# EAGLE design BSK5 (EAGLE 9.4.2)
ESKD_DESCRIPTION1: 207|235|224|242|224|32|193|209|202|53; ESKD_DESCRIPTION2: 241|245|229|236|224|32|253|235|229|234|242|240|232|247|229|241|234|224|255; ESKD_DESCRIPTION3: 239|240|232|237|246|232|239|232|224|235|252|237|224|255; ESKD_NUMBER: 67|67|83|49|46|50|54|48|48|45|48|221|51; ESKD_NUMBER_SHEET: 49; ESKD_SHEETS: 49
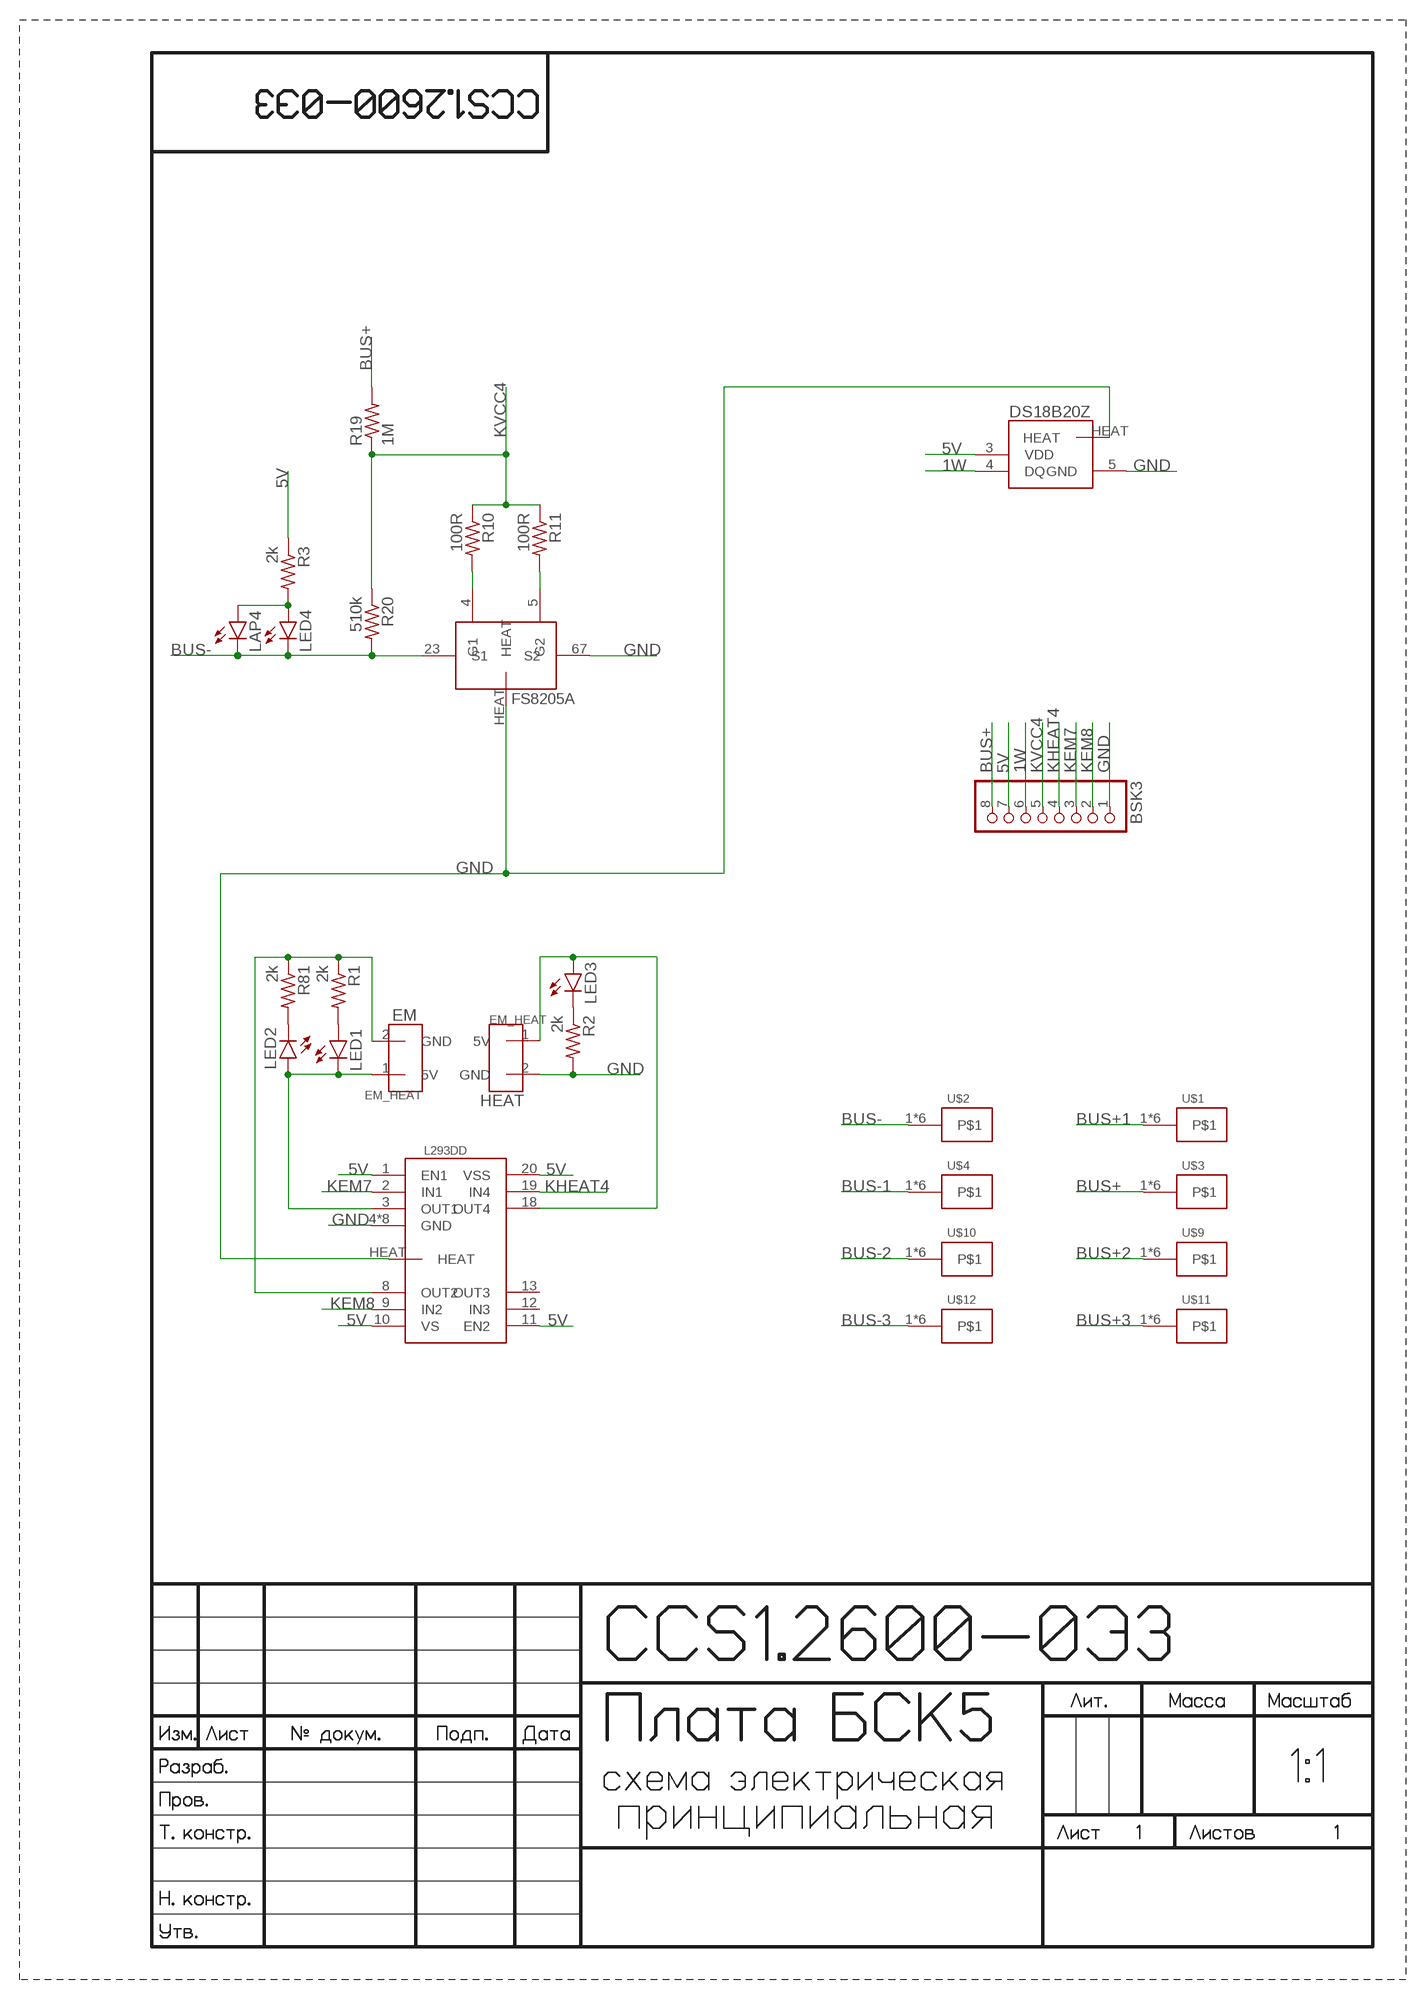
[diagram p0: schematic, sheet 1]

## Parts
BSK3  PINHD-1X8  [1X08]
DS18B20  DS18B20Z  [DS18B20Z]
FS8205A  FS8205A+  [FS8205A+]
L293DD  L293DD  [L293DD]
LAP4  LAP4-BOTTOM  [P47F-BOTTOM]
LED1  LEDCHIPLED_0603  [CHIPLED_0603]
LED2  LEDCHIPLED_0603  [CHIPLED_0603]
LED3  LEDCHIPLED_0603  [CHIPLED_0603]
LED4  LEDCHIPLED_0603  [CHIPLED_0603]
R1  2k  R-US_R0603  [R0603]
R2  2k  R-US_R0603  [R0603]
R3  2k  R-US_R0603  [R0603]
R10  100R  R-US_R0603  [R0603]
R11  100R  R-US_R0603  [R0603]
R19  1M  R-US_R0603  [R0603]
R20  510k  R-US_R0603  [R0603]
R81  2k  R-US_R0603  [R0603]
U$1  KCONNECT  [KCONNECT]
U$2  KCONNECT  [KCONNECT]
U$3  KCONNECT  [KCONNECT]
U$4  KCONNECT  [KCONNECT]
U$6  EM_HEAT  [EM_HEAT]
U$7  EM_HEAT  [EM_HEAT]
U$9  KCONNECT  [KCONNECT]
U$10  KCONNECT  [KCONNECT]
U$11  KCONNECT  [KCONNECT]
U$12  KCONNECT  [KCONNECT]

## Nets
1W: BSK3.6 DS18B20.4(DQ)
5V: BSK3.7 DS18B20.3(VDD) L293DD.1(EN1) L293DD.10(VS) L293DD.11(EN2) L293DD.20(VSS) R3.1
BUS+: BSK3.8 R19.2 U$3.1 U$3.2 U$3.3 U$3.4 U$3.P$1 U$3.P$2
BUS+1: U$1.1 U$1.2 U$1.3 U$1.4 U$1.P$1 U$1.P$2
BUS+2: U$9.1 U$9.2 U$9.3 U$9.4 U$9.P$1 U$9.P$2
BUS+3: U$11.1 U$11.2 U$11.3 U$11.4 U$11.P$1 U$11.P$2
BUS-: FS8205A.23(S1) LAP4.C LED4.C R20.2 U$2.1 U$2.2 U$2.3 U$2.4 U$2.P$1 U$2.P$2
BUS-1: U$4.1 U$4.2 U$4.3 U$4.4 U$4.P$1 U$4.P$2
BUS-2: U$10.1 U$10.2 U$10.3 U$10.4 U$10.P$1 U$10.P$2
BUS-3: U$12.1 U$12.2 U$12.3 U$12.4 U$12.P$1 U$12.P$2
GND: BSK3.1 DS18B20.5(GND) DS18B20.HEAT FS8205A.67(S2) FS8205A.HEAT L293DD.4(GND) L293DD.5(GND) L293DD.6(GND) L293DD.7(GND) L293DD.14(GND) L293DD.15(GND) L293DD.16(GND) L293DD.17(GND) L293DD.HEAT R2.2 U$7.2(GND)
KEM7: BSK3.3 L293DD.2(IN1)
KEM8: BSK3.2 L293DD.9(IN2)
KHEAT4: BSK3.4 L293DD.19(IN4)
KVCC4: BSK3.5 R10.1 R11.1 R19.1 R20.1
N$1: L293DD.3(OUT1) LED1.C LED2.A U$6.1(5V)
N$2: L293DD.8(OUT2) R1.1 R81.1 U$6.2(GND)
N$3: L293DD.18(OUT4) LED3.A U$7.1(5V)
N$8: FS8205A.4(G1) R10.2
N$9: FS8205A.5(G2) R11.2
N$26: LED2.C R81.2
N$27: LED1.A R1.2
N$28: LED3.C R2.1
N$29: LAP4.A LED4.A R3.2
Unconnected: L293DD.12(IN3) L293DD.13(OUT3)

## Notes on the sheet
- EM
- HEAT

## Library data of the parts
BSK3 = pinheadCS:PINHD-1X8: PIN HEADER
DS18B20 = CanCubeSat:DS18B20Z
FS8205A = CanCubeSat:FS8205A+
L293DD = CanCubeSat:L293DD
LAP4 = led:*P4: PointLED® Enhanced Thinfilm LED TOP & BOTTOM mount LS P47F, LR P47F, LA P47F, LY P47F, LT P4SG, LB P4SG, LW P4SG Source: http://catalog.osram-os.com .. LA_LR_LS_LY_P47F_Pb_free.pdf
LED1-LED4 = led:LED: LED OSRAM: - CHIPLED LG R971, LG N971, LY N971, LG Q971, LY Q971, LO R971, LY R971 LH N974, LH R974 LS Q976, LO Q976, LY Q976 LO Q996 - Hyper CHIPLED LW Q18S LB Q993, LB Q99A, LB R99A - SideLED LS A670, LO A670, LY A670, LG A670, LP A670 LB A673, LV A673, LT A673, LW A673 LH A674 LY A675 LS A676, LA A676, LO A676, LY A676, LW A676 LS A679, LY A679, LG A679 - Hyper Micro SIDELED® LS Y876, LA Y876, LO Y876, LY Y876 LT Y87S - SmartLED LW L88C, LW L88S LB L89C, LB L89S, LG L890 LS L89K, LO L89K, LY L89K LS L896, LA L896, LO L896, LY L896 - TOPLED LS T670, LO T670, LY T670, LG T670, LP T670 LSG T670, LSP T670, LSY T670, LOP T670, LYG T670 LG T671, LOG T671, LSG T671 LB T673, LV T673, LT T673, LW T673 LH T674 LS T676, LA T676, LO T676, LY T676, LB T676, LH T676, LSB T676, LW T676 LB T67C, LV T67C, LT T67C, LS T67K, LO T67K, LY T67K, LW E67C LS E67B, LA E67B, LO E67B, LY E67B, LB E67C, LV E67C, LT E67C LW T67C LS T679, LY T679, LG T679 LS T770, LO T770, LY T770, LG T770, LP T770 LB T773, LV T773, LT T773, LW T773 LH T774 LS E675, LA E675, LY E675, LS T675 LS T776, LA T776, LO T776, LY T776, LB T776 LHGB T686 LT T68C, LB T68C - Hyper Mini TOPLED® LB M676 - Mini TOPLED Santana® LG M470 LS M47K, LO M47K, LY M47K Source: http://www.osram.convergy.de LUXEON: - LUMILED® LXK2-PW12-R00, LXK2-PW12-S00, LXK2-PW14-U00, LXK2-PW14-V00 LXK2-PM12-R00, LXK2-PM12-S00, LXK2-PM14-U00 LXK2-PE12-Q00, LXK2-PE12-R00, LXK2-PE12-S00, LXK2-PE14-T00, LXK2-PE14-U00 LXK2-PB12-K00, LXK2-PB12-L00, LXK2-PB12-M00, LXK2-PB14-N00, LXK2-PB14-P00, LXK2-PB14-Q00 LXK2-PR12-L00, LXK2-PR12-M00, LXK2-PR14-Q00, LXK2-PR14-R00 LXK2-PD12-Q00, LXK2-PD12-R00, LXK2-PD12-S00 LXK2-PH12-R00, LXK2-PH12-S00 LXK2-PL12-P00, LXK2-PL12-Q00, LXK2-PL12-R00 Source: www.luxeon.com KINGBRIGHT: KA-3528ASYC Source: www.kingbright.com
R1-R3 R10 R11 R19 R20 R81 = resistor:R-US_: RESISTOR, American symbol
U$1-U$4 U$9-U$12 = CanCubeSat:KCONNECT
U$6 U$7 = CanCubeSat:EM_HEAT

## Board
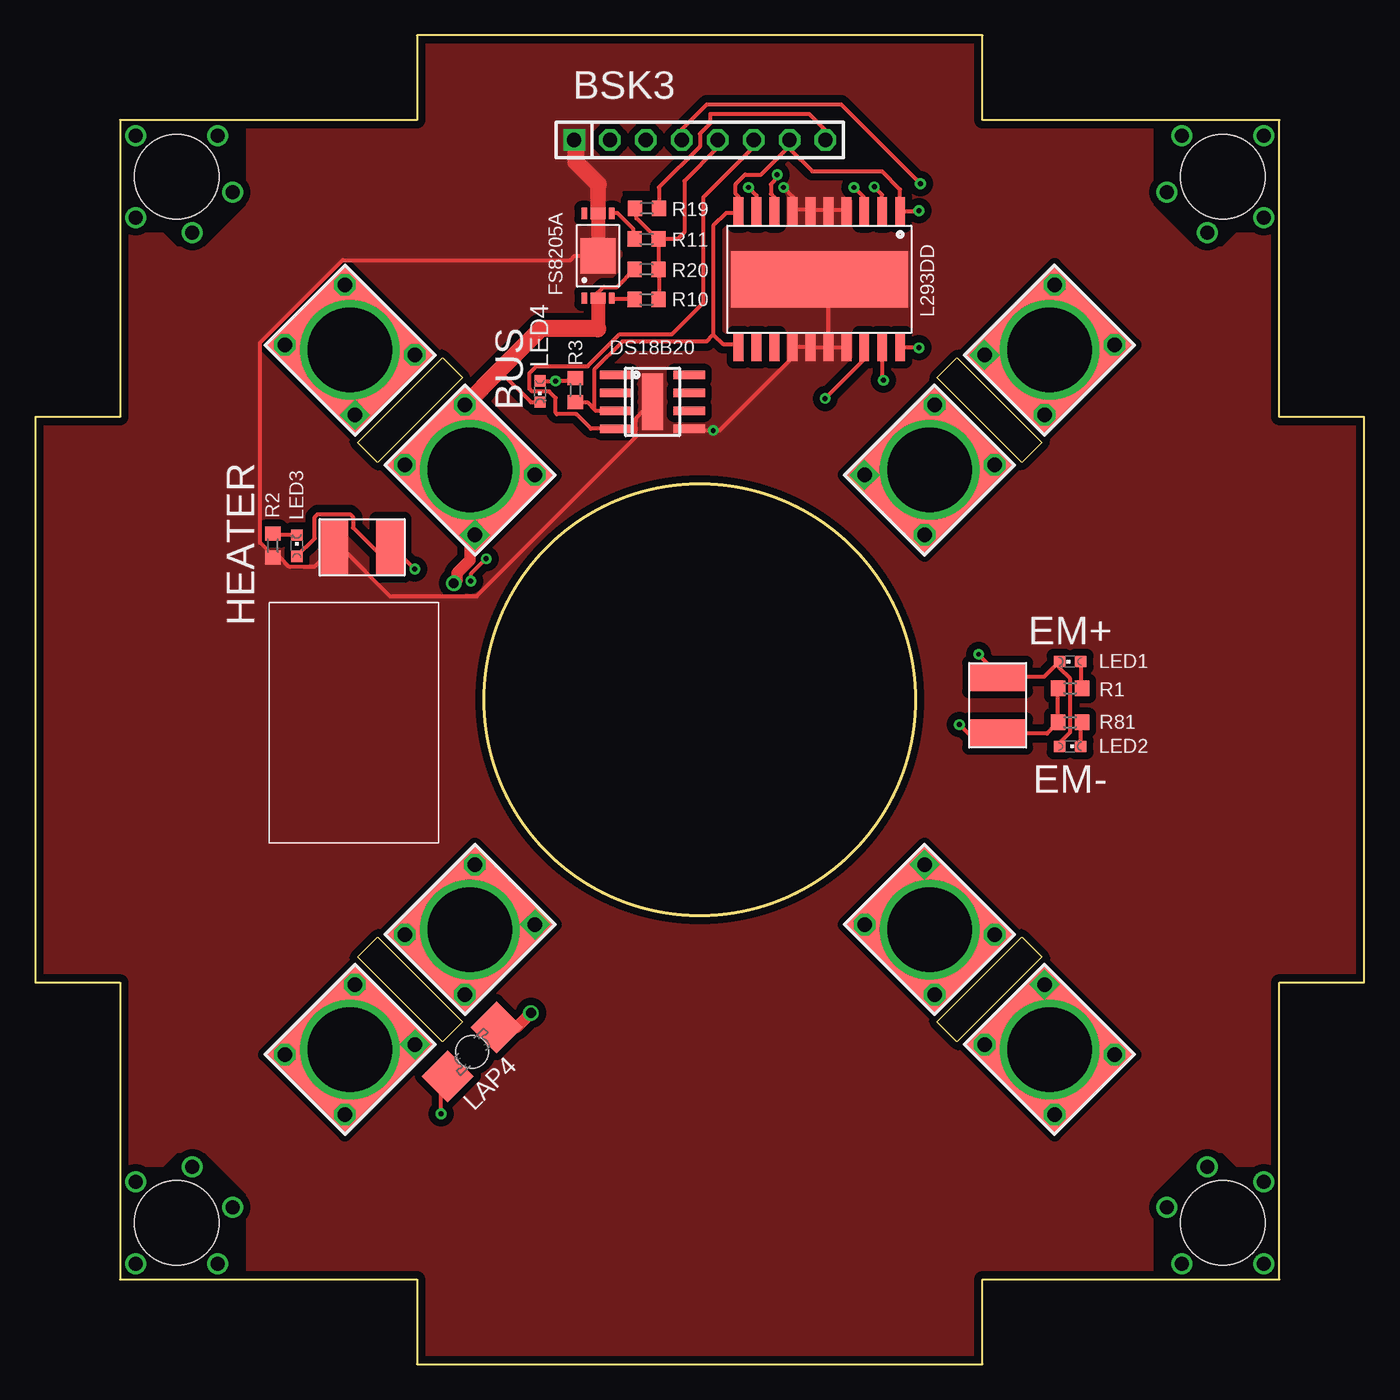
[diagram p1: board, top side]
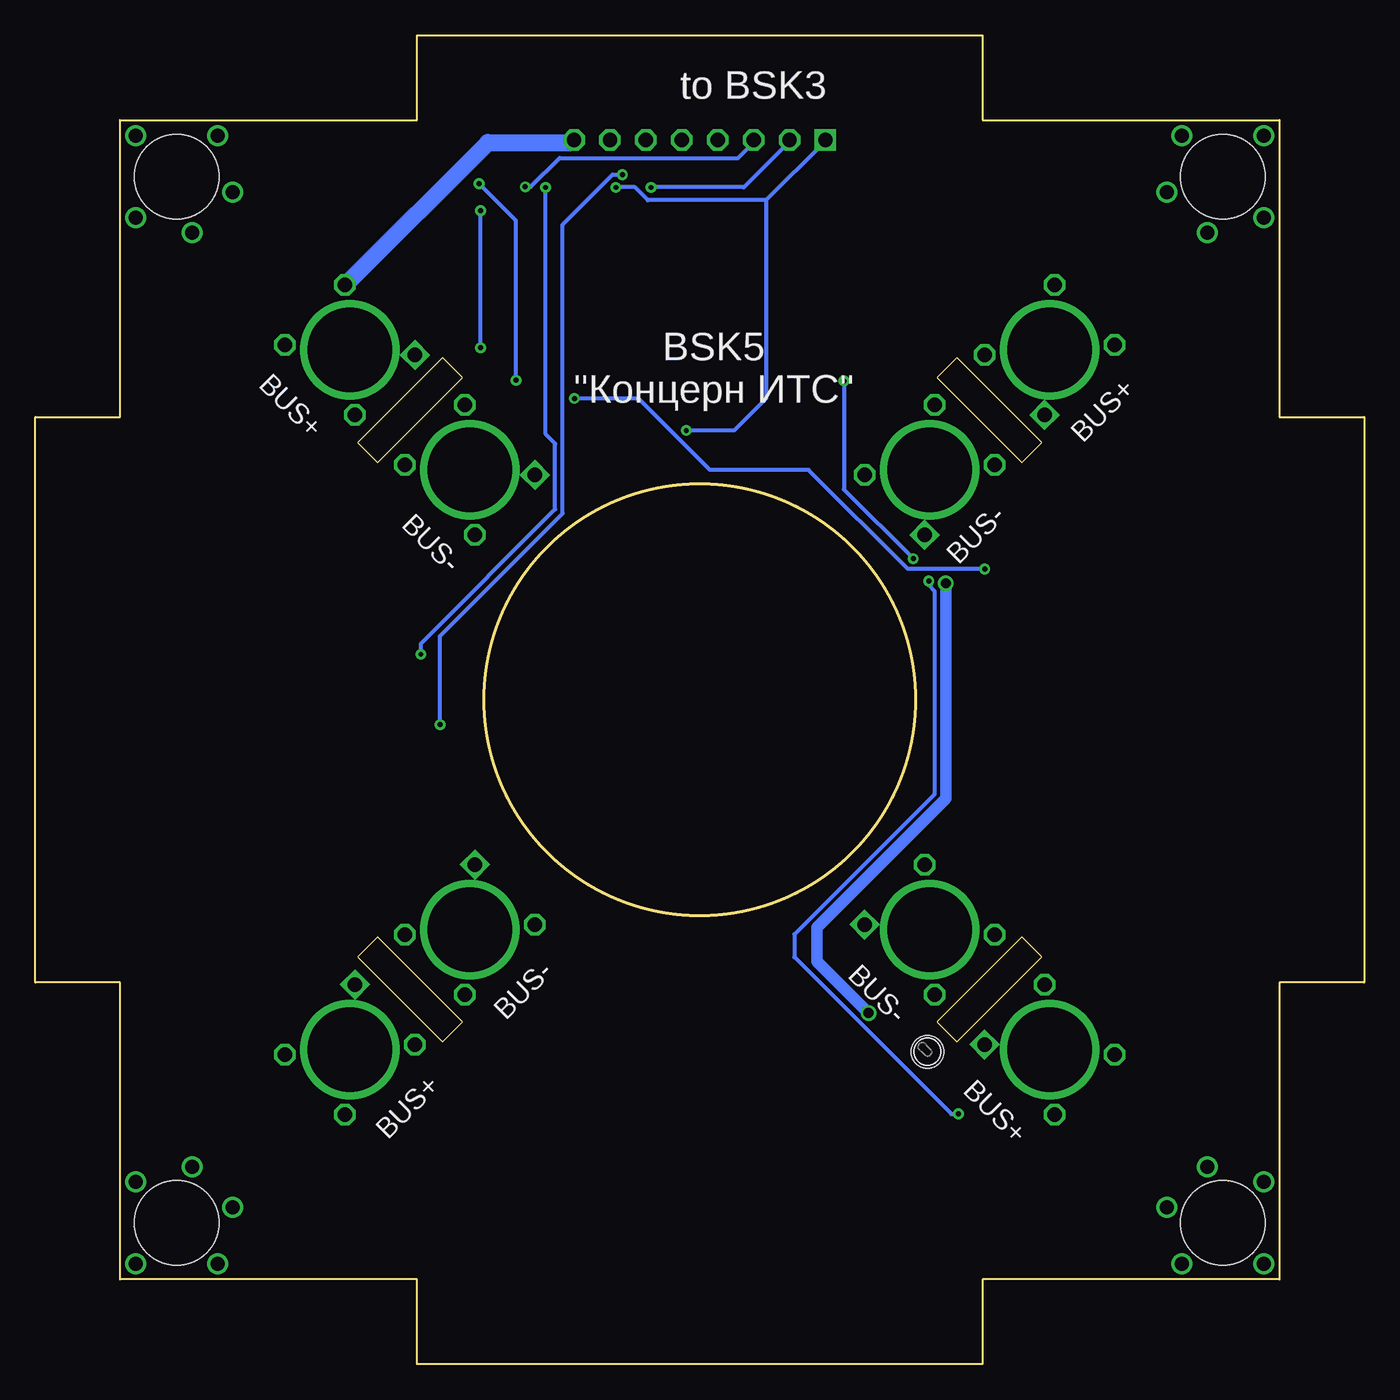
[diagram p2: board, bottom side, seen from below]

Size 94 x 94 mm. Coordinates in mm from the lower left corner, seen from the top.
Outline: 27,0 67,0 67,6 88,6 88,27 94,27 94,67 88,67 88,88 67,88 67,94 27,94 27,88 6,88 6,67 0,67 0,27 6,27 6,6 27,6 27,0
Outline: 63.79,24.2 69.8,30.21 71.22,28.79 65.21,22.78 63.79,24.2
Outline: 22.78,65.21 28.79,71.22 30.21,69.8 24.2,63.79 22.78,65.21
Outline: 69.8,63.79 63.79,69.8 65.21,71.22 71.22,65.21 69.8,63.79
Outline: 28.79,22.78 22.78,28.79 24.2,30.21 30.21,24.2 28.79,22.78
Outline: circle at 47,47 radius 15.25
Copper layers (1*16): Top 0.035mm / dielectric 1.5mm / Bottom 0.035mm
Design rules "default *": minimum track width 0.3mm, minimum drill 0.35mm, track to track 0.2mm, track to pad 0.2mm, pad to pad 0.2mm, via to via 0.2mm, smd to smd 0.2mm, copper to edge 0.25mm, drill to drill 6mil, minimum pad ring 10mil, minimum via ring 8mil, stop-mask expansion 2mil, vias tented up to drill 0mil, thermal gap 10mil
Holes 6 mm at 10,10 84,84 10,84 84,10

### Footprints (pad centres in the part's own frame; a part is rotated, then mirrored left to right if it is on the bottom)
1X08 = drill 1.016 square: 1 -8.89,0 | drill 1.016 octagon: 2 -6.35,0; 3 -3.81,0; 4 -1.27,0; 5 1.27,0; 6 3.81,0; 7 6.35,0; 8 8.89,0
DS18B20Z = smd 0.6 x 2.2: 1 -1.905,-2.6; 2 -0.635,-2.6; 3 0.635,-2.6; 4 1.905,-2.6; 5 1.905,2.6; 6 0.635,2.6; 7 -0.635,2.6; 8 -1.905,2.6 | smd 4 x 1.5: HEAT 0,0
FS8205A+ = smd 0.4 x 0.8: 1 -0.975,-3; 4 0.975,-3; 5 0.975,3; 8 -0.975,3 | smd 1.05 x 0.8: 23 0,-3; 67 0,3 | smd 2.5 x 2.5: HEAT 0,0
L293DD = smd 0.7 x 2: 1 -5.715,-4.8; 2 -4.445,-4.8; 3 -3.175,-4.8; 4 -1.905,-4.8; 5 -0.635,-4.8; 6 0.635,-4.8; 7 1.905,-4.8; 8 3.175,-4.8; 9 4.445,-4.8; 10 5.715,-4.8; 11 5.715,4.8; 12 4.445,4.8; 13 3.175,4.8; 14 1.905,4.8; 15 0.635,4.8; 16 -0.635,4.8; 17 -1.905,4.8; 18 -3.175,4.8; 19 -4.445,4.8; 20 -5.715,4.8 | smd 12.5 x 4: HEAT 0,0
P47F-BOTTOM = smd 2.6 x 2.6: A -2.45,0; C 2.45,0 | hole 2.3: 0,0
CHIPLED_0603 = smd 0.8 x 0.8: A 0,-0.75; C 0,0.75
R0603 = smd 1 x 1.1: 1 -0.85,0; 2 0.85,0
KCONNECT = drill 1.016 square: 1 -3,-3.5 | drill 1.016 octagon: 2 -3,3.5; 3 3,-3.5; 4 3,3.5 | drill 6: P$1 0,0 | smd 8 x 9: P$2 0,0
EM_HEAT = smd 2 x 4: 1 -2,0; 2 2,0

### Placement (x,y rotation side)
BSK3  47,86.6 0 top
DS18B20  43.66,68.07 270 top
FS8205A  39.8,78.41 0 top
L293DD  55.46,76.74 180 top
LAP4  30.9,22.1 45 top
LED1  73.2,49.7 90 top
LED2  73.2,43.7 270 top
LED3  18.5,57.9 0 top
LED4  35.7,68.8 180 top
R1  73.2,47.8 0 top
R2  16.8,57.9 270 top
R3  38.2,68.9 90 top
R10  43.24,75.31 180 top
R11  43.24,79.59 180 top
R19  43.26,81.77 0 top
R20  43.24,77.45 180 top
R81  73.2,45.4 0 top
U$1  22.25,71.75 45 top
U$2  30.74,63.26 45 top
U$3  71.75,71.75 315 top
U$4  63.26,63.26 315 top
U$6  68.07,46.61 270 top
U$7  23.11,57.78 180 top
U$9  22.25,22.25 135 top
U$10  30.74,30.74 135 top
U$11  71.75,22.25 225 top
U$12  63.26,30.74 225 top

### Tracks (layer width: path | path; a pad name or v marks a point on that pad's centre or on a via)
1W
  Top 0.3: DS18B20.4 39.3,66.17 38.27,67.2 36.91,67.2 36.8,67.31 36.8,68.34 36.34,68.8 35.16,68.8 34.95,69 34.95,70.09 35.45,70.6 39.08,70.6 41.33,72.85 45.03,72.85 47.26,75.08 47.26,82.55 50.81,86.1 BSK3.6
5V  (via drill 0.35)
  Top 0.3: 47.95,72.84 48.63,72.16 49.54,72.16 L293DD.11 | 47.95,72.84 47.95,80.53 48.86,81.43 49.54,81.43 L293DD.10 49.76,81.66 49.76,82.56 49.54,82.79 49.54,83.47 50.22,84.15 51.35,84.15 53.35,86.15 BSK3.7 53.35,85.99 54.97,84.37 59.9,84.37 61.17,83.1 L293DD.1 62.44,81.54 v62.5,81.6 | 47.95,72.84 47.47,72.35 41.53,72.35 39.53,70.35 39.53,67.56 | L293DD.20 62.26,71.94 62.3,71.9 v62.5,71.9 | DS18B20.3 39.66,67.44 39.53,67.56 | R3.1 39.05,68.05 39.53,67.56
  Bottom 0.3: v62.5,71.9 v62.5,81.6
BUS+
  Top 0.3: R19.2 44.11,81.88 44.11,83.24 47,86.14 47,87.04 47.73,87.77 47.73,88.43 54.75,88.43 55.89,87.3 BSK3.8 | 71.48,71.48 71.48,67.18 U$3.3 | U$3.P$2 71.48,71.48 | 71.48,71.48 67.18,71.48 U$3.1 | 72.16,71.93 71.93,71.93 U$3.P$2 | 72.16,71.93 76.23,71.93 U$3.4 | 72.16,71.93 72.16,76.23 U$3.2 | 72.16,71.93 U$3.P$2
  Bottom 1.2: BSK3.8 56.1,86.41 61.98,86.41 71.93,76.46 U$3.2
BUS+1
  Top 0.3: 21.94,71.93 22.17,71.93 U$1.P$2 | 21.94,71.93 17.87,71.93 U$1.2 | 21.94,71.93 21.94,76.23 U$1.4 | 21.94,71.93 U$1.P$2 | 22.39,71.48 22.39,71.7 U$1.P$2 | 22.39,71.48 22.39,67.18 U$1.1 | 22.39,71.48 26.69,71.48 U$1.3 | 22.39,71.48 U$1.P$2
BUS+2
  Top 0.3: 21.94,21.94 21.94,17.87 U$9.2 | U$9.P$2 21.94,21.94 | 21.94,21.94 17.87,21.94 U$9.4 | 22.39,22.62 22.39,22.39 U$9.P$2 | 22.39,22.62 22.39,26.69 U$9.3 | 22.39,22.62 26.69,22.62 U$9.1 | 22.39,22.62 U$9.P$2
BUS+3
  Top 0.3: 71.93,21.94 71.93,22.17 U$11.P$2 | 71.93,21.94 71.93,17.87 U$11.4 | 71.93,21.94 76.23,21.94 U$11.2 | 71.93,21.94 U$11.P$2 | 71.48,22.39 71.7,22.39 U$11.P$2 | 71.48,22.39 67.18,22.39 U$11.3 | 71.48,22.39 71.48,26.69 U$11.1 | 71.48,22.39 U$11.P$2
BUS-  (via drill 0.7)
  Top 0.3: 30.99,62.88 30.99,58.81 U$2.1 | 30.99,62.88 30.76,63.11 U$2.P$2 | 30.99,62.88 35.29,62.88 U$2.3 | 30.99,62.88 U$2.P$2 | 30.31,63.56 26.24,63.56 U$2.2 | 30.31,63.56 30.54,63.34 U$2.P$2 | 30.31,63.56 30.31,66.28 U$2.P$2 | 30.31,63.56 U$2.P$2 | FS8205A.23 39.8,75.8 40.2,76.2 41.14,76.2 R20.2 | 32.81,70.29 35.05,68.05 LED4.C
  Top 0.8: U$2.P$2 30.74,56.87 29.82,55.96 29.82,55.46 v29.6,55.24 | v35.06,24.84 34.05,23.83 LAP4.C
  Top 1: FS8205A.23 39.8,73.24
  Top 1.2: 30.31,66.28 30.31,67.63 U$2.4 32.81,70.29 35.76,73.24 39.8,73.24
  Bottom 0.8: v29.6,55.24 29.6,40 38.7,30.9 38.7,28.48 v35.06,24.84
BUS-1
  Top 0.3: 62.88,63.11 63.11,63.11 U$4.P$2 | 62.88,63.11 58.81,63.11 U$4.1 | 62.88,63.11 62.88,58.81 U$4.3 | 62.88,63.11 U$4.P$2 | 63.56,63.56 67.63,63.56 U$4.4 | 63.56,63.56 63.56,67.63 U$4.2 | 63.56,63.56 U$4.P$2
BUS-2
  Top 0.3: 30.54,30.54 30.54,26.24 U$10.2 | 30.54,30.54 26.24,30.54 U$10.4 | 30.54,30.54 U$10.P$2 | 30.99,31.22 30.99,30.99 U$10.P$2 | 30.99,31.22 30.99,35.29 U$10.3 | 30.99,31.22 35.29,31.22 U$10.1 | 30.99,31.22 U$10.P$2
BUS-3
  Top 0.3: 63.56,30.31 63.56,26.24 U$12.4 | 63.56,30.31 63.34,30.54 U$12.P$2 | 63.56,30.31 67.63,30.31 U$12.2 | 63.56,30.31 U$12.P$2 | 62.88,30.99 58.81,30.99 U$12.3 | 62.88,30.99 63.11,30.76 U$12.P$2 | 62.88,30.99 62.88,35.29 U$12.1 | 62.88,30.99 U$12.P$2
GND  (via drill 0.35)
  Top 0.3: L293DD.16 55.87,71.93 54.97,71.93 L293DD.15 54.74,71.93 53.61,71.93 L293DD.14 53.38,71.93 53.38,71.03 48.41,66.05 v47.95,66.05 46.37,66.05 DS18B20.5 | L293DD.17 57.23,71.93 L293DD.16 | 53.61,81.66 54.74,81.66 L293DD.6 54.97,81.66 55.87,81.66 L293DD.5 56.1,81.66 57.23,81.66 L293DD.4 | 53.61,81.66 53.61,82.56 v52.93,83.24 | 53.61,81.66 L293DD.7 | L293DD.16 56.09,76.11 L293DD.HEAT | FS8205A.HEAT 38.16,78.41 37.86,78.11 21.75,78.11 15.89,72.25 15.89,58.11 16.8,57.2 R2.2 17.3,57.05 17.95,56.4 19.73,56.4 U$7.2 21.62,57.78 25.07,54.34 31.22,54.34 42.51,65.62 42.51,66.92 DS18B20.HEAT
  Top 1: FS8205A.67 FS8205A.HEAT
  Top 1.1: 39.81,83.47 FS8205A.67
  Top 1.2: 39.81,83.47 38.23,85.05 38.23,86.41 BSK3.1
  Bottom 0.3: v52.93,83.24 51.57,83.24 50.67,82.34 42.3,82.34 | 42.3,82.34 38.23,86.41 BSK3.1 | 42.3,82.34 42.3,68.31 44.56,66.05 v47.95,66.05
  pour Top (isolate 0.5, no thermals): 6,80 9,80 10,79 12,79 15,82 15,88 27,88 27,94 67,94 67,88 78,88 79,88 79,82 82,79 84,79 85,80 88,80 88,67 94,67 94,27 88,27 88,15 88,14 85,14 84,15 82,15 79,12 79,6 67,6 67,0 27,0 27,6 15,6 15,12 12,15 10,15 9,14 6,14 6,27 0,27 0,67 6,67
  cutout Top: 22.25,65.25 24.25,63.25 30.75,69.75 28.75,71.75
  cutout Top: 41.6,74.1 44.9,74.1 44.9,82.9 41.6,82.9
HEAT1
  cutout Top: 63.25,24.25 65.25,22.25 71.75,28.75 69.75,30.75
HEAT2
  cutout Top: 69.7,63.3 71.7,65.3 65.3,71.7 63.3,69.7
HEAT3
  cutout Top: 28.75,22.25 30.75,24.25 24.25,30.75 22.25,28.75
KEM7  (via drill 0.35)
  Top 0.3: L293DD.2 59.91,82.72 v59.34,83.28
  Bottom 0.3: v59.34,83.28 58.95,83.28 56.92,85.32 44.29,85.32 43.2,86.41 BSK3.3
KEM8  (via drill 0.35)
  Top 0.3: v50.44,83.24 51.02,82.67 L293DD.9
  Bottom 0.3: v50.44,83.24 43.88,83.24 40.72,86.41 BSK3.2
KHEAT4  (via drill 0.35)
  Top 0.3: v62.61,83.51 57,89.12 47.5,89.12 45.73,87.35 BSK3.4 | L293DD.19 59.91,69.69 v60,69.6
  Bottom 0.3: v60,69.6 60,80.9 v62.61,83.51
KVCC4
  Top 0.3: R10.1 44.11,75.33 44.11,77.36 R20.1 44.11,77.59 44.11,79.4 R11.1 | R19.1 42.53,81.66 42.53,81.05 43.97,79.61 R11.1 | R11.1 44.11,79.62 45.47,79.62 45.92,80.08 45.92,83.69 48.27,86.05 BSK3.5
N$1  (via drill 0.35)
  Top 0.3: v66.73,50.22 67.86,49.09 67.86,48.63 U$6.1 71.36,48.61 LED1.C 72.45,49.24 73.2,48.49 73.2,44.7 72.45,43.95 LED2.A | L293DD.3 58.63,82.51 v57.91,83.24
  Bottom 0.3: v57.91,83.24 57.91,65.79 57.23,65.11 57.23,60.48 66.73,50.98 v66.73,50.22
N$2  (via drill 0.35)
  Top 0.3: v52.48,84.15 52.48,83.92 52.03,83.47 52.03,82.79 52.25,82.56 52.25,81.66 L293DD.8 | v65.37,45.24 66.05,44.56 68.02,44.56 U$6.2 71.56,44.61 R81.1 R1.1
  Bottom 0.3: v52.48,84.15 53.16,84.15 56.7,80.61 56.7,60.17 65.37,51.49 v65.37,45.24
N$3  (via drill 0.35)
  Top 0.3: v55.87,68.31 58.59,71.03 58.59,71.93 L293DD.18 | v26.84,56.25 25.3,57.78 U$7.1 24.48,57.15 22.46,59.16 22.46,59.93 22.26,60.13 19.97,60.13 19.76,59.93 19.76,58.41 LED3.A
  Bottom 0.3: v55.87,68.31 51.35,68.31 46.29,63.26 39.3,63.26 32.29,56.25 v26.84,56.25
N$4  (via drill 1)
  other vias: 7.1,7.1
N$5  (via drill 1)
  other vias: 12.9,7.1
N$6  (via drill 1)
  other vias: 86.9,7.1
N$7  (via drill 1)
  other vias: 86.9,12.9
N$8
  Top 0.3: FS8205A.4 40.94,75.33 42.3,75.33 R10.2
N$9
  Top 0.3: FS8205A.5 40.94,81.43 41.17,81.43 42.3,80.3 42.3,79.62 R11.2
N$10  (via drill 1)
  other vias: 7.1,12.9
N$11  (via drill 1)
  other vias: 11.1,13.95
N$12  (via drill 1)
  other vias: 13.95,11.1
N$13  (via drill 1)
  other vias: 81.1,7.1
N$14  (via drill 1)
  other vias: 80.05,11.1
N$15  (via drill 1)
  other vias: 82.9,13.95
N$16  (via drill 1)
  other vias: 86.9,86.9
N$17  (via drill 1)
  other vias: 81.1,86.9
N$18  (via drill 1)
  other vias: 86.9,81.1
N$19  (via drill 1)
  other vias: 82.9,80.05
N$20  (via drill 1)
  other vias: 80.05,82.9
N$21  (via drill 1)
  other vias: 7.1,86.9
N$22  (via drill 1)
  other vias: 7.1,81.1
N$23  (via drill 1)
  other vias: 12.9,86.9
N$24  (via drill 1)
  other vias: 13.95,82.9
N$25  (via drill 1)
  other vias: 11.1,80.05
N$26
  Top 0.3: LED2.C 73.95,45.3 R81.2
N$27
  Top 0.3: LED1.A 73.95,47.9 R1.2
N$28
  Top 0.3: LED3.C 16.9,58.65 R2.1
N$29  (via drill 0.35)
  Top 0.3: LED4.A v36.8,69.55 38,69.55 R3.2 | v31.9,56.98 30.8,55.88 v30.8,55.4 | v28.7,17.7 28.7,19.9 LAP4.A
  Bottom 0.3: v36.8,69.55 36.8,61.88 v31.9,56.98 | v30.8,55.4 30.8,55.1 30.4,54.7 30.4,40.3 40.3,30.4 40.3,28.8 29.2,17.7 v28.7,17.7

### Text on the board
tNames: BUS | HEATER | EM+ | EM-
bNames: to BSK3 | BSK5 / "Концерн ИТС" | BUS+ | BUS+ | BUS- | BUS- | BUS- | BUS- | BUS+ | BUS+